# EAGLE design USB-I2C (EAGLE 6.4)
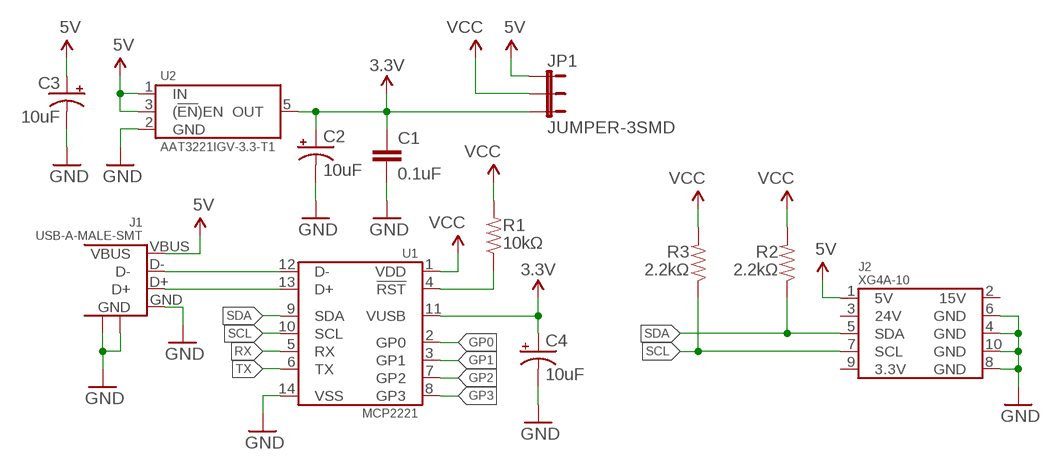
[diagram p0: schematic, sheet 1]

## Parts
C1  0.1uF  CAP-0805  [0805-CAP]
C2  10uF  CAP_POL0805  [0805-CAP_POL]
C3  10uF  CAP_POL0805  [0805-CAP_POL]
C4  10uF  CAP_POL0805  [0805-CAP_POL]
J1  USB-A-MALE-SMT  [USB-A-MALE-SMT]
J2  XG4A-10  [M05X2_SHROUD]
JP1  JUMPER-3SMD  [SJ_3]
R1  10kΩ  RESISTOR-0805  [0805-RES]
R2  2.2kΩ  RESISTOR-0805  [0805-RES]
R3  2.2kΩ  RESISTOR-0805  [0805-RES]
U1  MCP2221  [SOIC-14]
U2  AAT3221IGV-3.3-T1  [SOT23-5]

## Nets
3.3V: C1.1 C2.A(+) C4.A(+) JP1.3 U1.11(VUSB) U2.5(OUT)
5V: C3.A(+) J1.VBUS J2.1(5V) JP1.1 U2.1(IN) U2.3((!EN!)EN)
D_N: J1.D- U1.12(D-)
D_P: J1.D+ U1.13(D+)
GND: C1.2 C2.C(-) C3.C(-) C4.C(-) J1.GND J1.P$1 J1.P$3 J2.4(GND) J2.6(GND) J2.8(GND) J2.10(GND) U1.14(VSS) U2.2(GND)
GP0: U1.2(GP0)
GP1: U1.3(GP1)
GP2: U1.7(GP2)
GP3: U1.8(GP3)
N$3: R1.1 U1.4(!RST)
RX: U1.5(RX)
SCL: J2.7(SCL) R3.1 U1.10(SCL)
SDA: J2.5(SDA) R2.1 U1.9(SDA)
TX: U1.6(TX)
VCC: JP1.2 R1.2 R2.2 R3.2 U1.1(VDD)
Unconnected: J2.2(15V) J2.3(24V) J2.9(3.3V)

## Library data of the parts
C1 = Passives:CAP
C2-C4 = SparkFun-Passives:CAP_POL: Capacitor Polarized These are standard SMD and PTH capacitors. Normally 10uF, 47uF, and 100uF in electrolytic and tantalum varieties. Always verify the external diameter of the through hole cap, it varies with capacity, voltage, and manufacturer. The EIA devices should be standard.
J1 = Connectors:USB
J2 = work:XG4A-10
JP1 = SparkFun-Passives:JUMPER-3
R1-R3 = Passives:RESISTOR
U1 = Microchip:MCP2221
U2 = Skyworks:AAT3221: 150mA 3.3v LDO Regulator

## Board
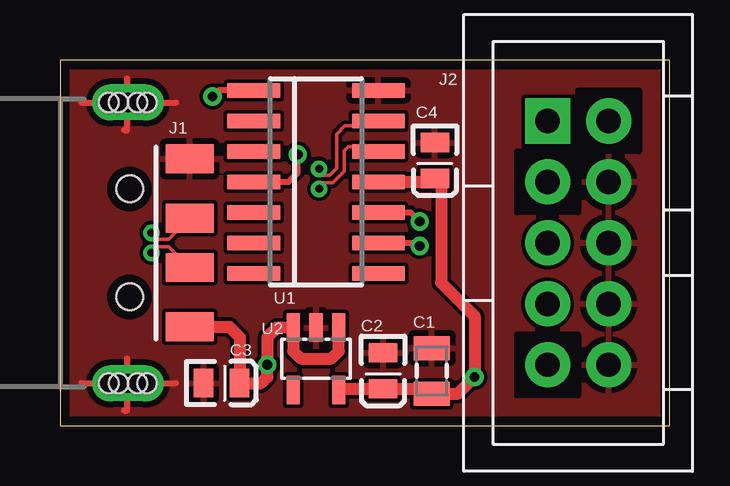
[diagram p1: board, top side]
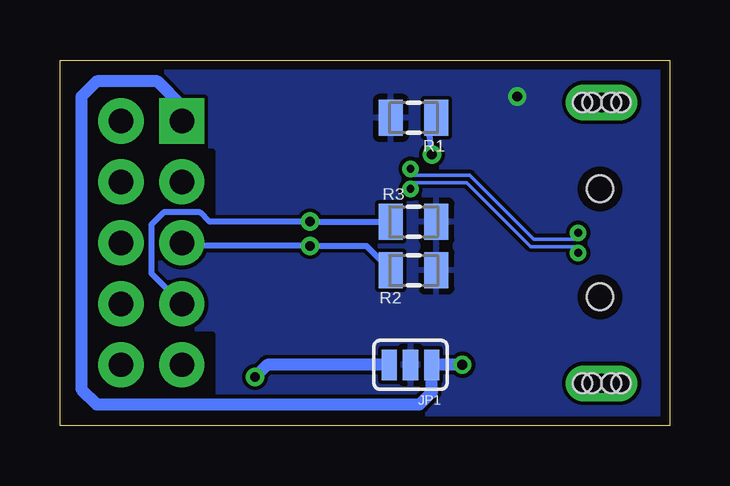
[diagram p2: board, bottom side, seen from below]

Size 25.4 x 15.24 mm. Coordinates in mm from the lower left corner, seen from the top.
Outline: 0,0 25.4,0 25.4,15.24 0,15.24 0,0
Copper layers (1*16): Top 0.0356mm / dielectric 1.5011mm / Bottom 0.0356mm
Design rules "oshpark-2layer *": minimum track width 6mil, minimum drill 13mil, track to track 6mil, track to pad 6mil, pad to pad 6mil, via to via 6mil, smd to smd 6mil, copper to edge 15mil, drill to drill 6mil, minimum pad ring 7mil, minimum via ring 7mil, stop-mask expansion 4mil, vias tented up to drill 20mil, thermal gap 10mil
tRestrict: 12 lines
bRestrict: 12 lines

### Footprints (pad centres in the part's own frame; a part is rotated, then mirrored left to right if it is on the bottom)
0805-CAP = smd 1 x 1.5: 1 -0.95,0; 2 0.95,0
0805-CAP_POL = smd 0.8 x 1.2: A 0.75,0; C -0.75,0
USB-A-MALE-SMT = smd 1.2 x 2: D+ 1.027,-5.4; D- -1.027,-5.4; GND 3.5,-5.4; VBUS -3.5,-5.4 | drill 0.8 pad 1.5 long: P$1 5.85,-2.83; P$3 -5.85,-2.83 | hole 1.1: 2.25,-2.9; -2.25,-2.9 | hole 0.8: -5.85,-3.23; -5.85,-3.63; -5.85,-2.43; -5.85,-2.03; 5.85,-3.23; 5.85,-3.63; 5.85,-2.43; 5.85,-2.03
M05X2_SHROUD = drill 1.016 pad 1.88 square: 1 -5.08,-1.27 | drill 1.016 pad 1.88: 2 -5.08,1.27; 3 -2.54,-1.27; 4 -2.54,1.27; 5 0,-1.27; 6 0,1.27; 7 2.54,-1.27; 8 2.54,1.27; 9 5.08,-1.27; 10 5.08,1.27
SJ_3 = smd 0.635 x 1.27: 1 -0.889,0; 2 0,0; 3 0.889,0
0805-RES = smd 1 x 1.5: 1 -0.95,0; 2 0.95,0
SOIC-14 = smd 2.2 x 0.6: 1 -2.6,3.81; 2 -2.6,2.54; 3 -2.6,1.27; 4 -2.6,0; 5 -2.6,-1.27; 6 -2.6,-2.54; 7 -2.6,-3.81; 8 2.6,-3.81; 9 2.6,-2.54; 10 2.6,-1.27; 11 2.6,0; 12 2.6,1.27; 13 2.6,2.54; 14 2.6,3.81
SOT23-5 = smd 1.2 x 0.55: 1 1.3,-0.95; 2 1.3,0; 3 1.3,0.95; 4 -1.3,0.95; 5 -1.3,-0.95

### Placement (x,y rotation side)
C1  15.49,2.29 90 top
C2  13.46,2.29 270 top
C3  6.73,1.78 0 top
C4  15.62,11.05 270 top
J1  0,7.62 90 top
J2  21.59,7.62 270 top
JP1  10.79,2.54 180 bottom
R1  10.67,12.83 180 bottom
R2  10.67,6.48 0 bottom
R3  10.67,8.51 0 bottom
U1  10.67,10.16 0 top
U2  10.67,2.79 90 top

### Tracks (layer width: path | path; a pad name or v marks a point on that pad's centre or on a via)
3.3V  (via drill 0.41)
  Top 0.508: U2.5 11.66,1.54 C2.A 15.29,1.54 C1.1 16.58,1.34 v17.27,2.03 17.27,4.57 15.88,5.97 15.88,10.16 15.48,10.16 | U1.11 15.48,10.16 | 15.48,10.16 C4.A
  Bottom 0.508: JP1.3 16.76,2.54 v17.27,2.03
5V  (via drill 0.41)
  Top 0.508: J1.VBUS 7.06,4.12 7.49,3.68 7.49,1.79 C3.A 8.38,1.78 8.64,2.03 v8.64,2.54 8.64,3.68 9.05,4.09 U2.3 9.72,3.11 10.03,2.79 11.3,2.79 11.62,3.11 U2.1
  Bottom 0.508: v8.64,2.54 JP1.1 9.91,1.4 10.41,0.89 23.88,0.89 24.51,1.52 24.51,13.72 23.88,14.35 21.34,14.35 20.32,13.34 J2.1
D_N  (via drill 0.33)
  Top 0.152: J1.D- 4.53,7.47 3.81,7.47 v3.81,7.2 | v10.79,9.87 10.79,10.13 11.37,10.13 11.84,10.61 11.84,11.47 12,11.63 13.06,11.63 U1.12
  Bottom 0.152: v3.81,7.2 3.81,7.47 5.78,7.47 8.45,10.13 10.79,10.13 v10.79,9.87
D_P  (via drill 0.33)
  Top 0.152: J1.D+ 4.53,7.77 3.81,7.77 v3.81,8.04 | v10.79,10.71 10.79,10.44 11.24,10.44 11.53,10.73 11.53,12.15 11.88,12.5 13.06,12.5 U1.13
  Bottom 0.152: v3.81,8.04 3.81,7.77 5.65,7.77 8.32,10.44 10.79,10.44 v10.79,10.71
GND
  Top 0.254: 0.89,1.78 2.54,1.78 | 2.54,1.78 4.83,1.78 | 2.67,0.64 2.79,0.64 2.79,2.79 | J1.P$3 2.54,1.77 2.54,1.78 | 0.89,13.46 2.54,13.46 | 2.54,13.46 4.83,13.46 | 2.67,12.32 2.79,12.32 2.79,13.47 | 2.79,14.48 2.79,13.72 2.79,13.47 | 2.83,13.45 2.54,13.45 2.54,13.46 | J1.P$1 2.79,13.47
  pour Top: -1.27,16.51 26.67,16.51 26.67,-1.27 -1.27,-1.27
N$3  (via drill 0.41)
  Top 0.254: U1.4 9.53,10.16 9.91,10.54 v9.91,11.3
  Bottom 0.254: v9.91,11.3 10.03,12.51 R1.1
SCL  (via drill 0.41)
  Top 0.254: U1.10 14.61,8.89 v14.99,8.51
  Bottom 0.254: R3.1 v14.99,8.51 19.18,8.51 19.56,8.89 21.08,8.89 21.59,8.38 21.59,6.35 J2.7
SDA  (via drill 0.41)
  Top 0.254: U1.9 14.86,7.62 v14.99,7.49
  Bottom 0.254: R2.1 12.63,7.49 v14.99,7.49 20.19,7.49 J2.5
VCC  (via drill 0.41)
  Top 0.254: U1.1 6.6,13.97 v6.35,13.72
  pour Bottom: -2.54,17.78 27.94,17.78 27.94,-2.54 -2.54,-2.54